# Altium schematic sheet LHS.SchDoc: LHS
size OrCAD A; ApprovedBy: Abbas Mahmoud; CheckedBy: Abbas Mahmoud; Author: Abbas Mahmoud; CompanyName: lsa 4wya :); DrawnBy: Abbas Mahmoud; Engineer: Abbas Mahmoud; DocumentNumber: 7; Revision: 1; SheetNumber: 7; SheetTotal: 8
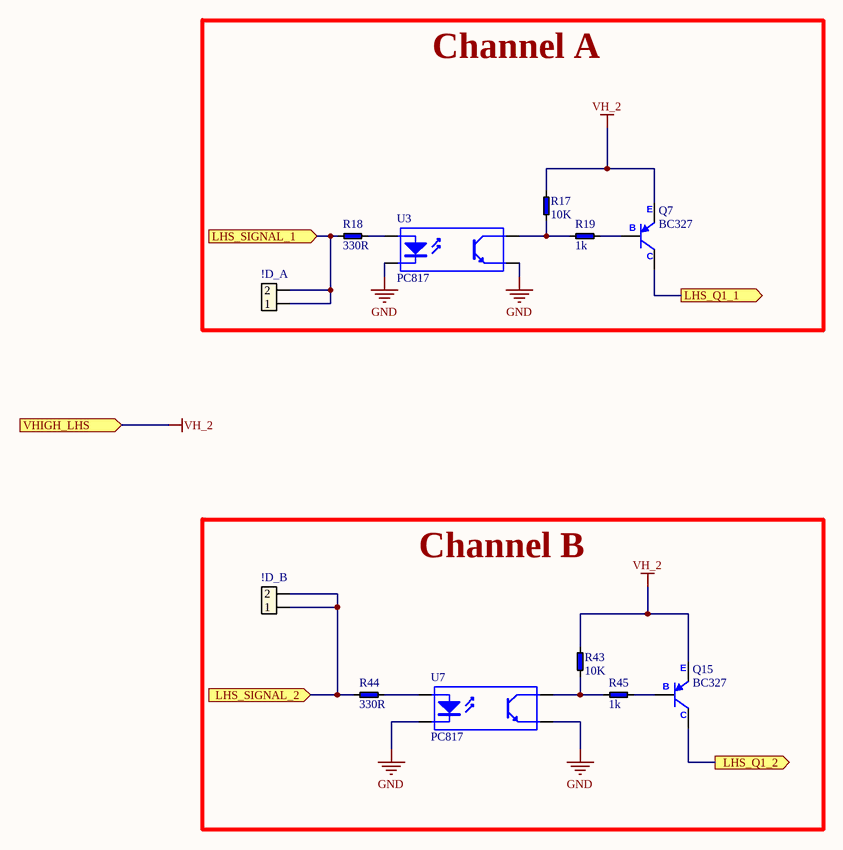
[diagram p0: LHS.SchDoc]

## Parts
!D_A  Header 2  [PINHEADER X2]  (value not drawn)
!D_B  Header 2  [PINHEADER X2]  (value not drawn)
Q7  BC327  [Transistor - duplicate3]
Q15  BC327  [Transistor - duplicate3]
R17  10K  [RESISTOR _9]
R18  330R  [RESISTOR _9]
R19  1k  [RESISTOR _9]
R43  10K  [RESISTOR _9]
R44  330R  [RESISTOR _9]
R45  1k  [RESISTOR _9]
U3  PC817  [IC X4 PIN]
U7  PC817  [IC X4 PIN]

## Blocks framed on the sheet
Channel A: !D_A Q7 R17-R19 U3
Channel B: !D_B Q15 R43-R45 U7

## Ports
LHS_Q1_1 (out), LHS_Q1_2 (out), LHS_SIGNAL_1 (in), LHS_SIGNAL_2 (in), VHIGH_LHS (in)

## Nets
GND: U3.2(K) U3.3(E) U7.2(K) U7.3(E)
VH_2: Q7.1(E) Q15.1(E) R17.1 R43.2 ; port VHIGH_LHS
LHS_Q1_1: Q7.3(C) ; port LHS_Q1_1
LHS_Q1_2: Q15.3(C) ; port LHS_Q1_2
LHS_SIGNAL_1: !D_A.1 !D_A.2 R18.1 ; port LHS_SIGNAL_1
LHS_SIGNAL_2: !D_B.1 !D_B.2 R44.1 ; port LHS_SIGNAL_2
NetQ7_2: Q7.2(B) R19.2
NetQ15_2: Q15.2(B) R45.2
NetR17_2: R17.2 R19.1 U3.4(C)
NetR18_2: R18.2 U3.1(A)
NetR43_1: R43.1 R45.1 U7.4(C)
NetR44_2: R44.2 U7.1(A)

## Notes on the sheet
- Title
- Size:
- Date:
- Orcad A
- Number:
- Time:
- Revision:
- Sheet
- of
- File:

## Library data of the parts
!D_A !D_B = Header 2: Header, 2-Pin; LatestRevisionDate: 17-Jul-2002; LatestRevisionNote: Re-released for DXP Platform.; Publisher: Altium Limited
Q7 Q15 = PNP
R17-R19 R43-R45 = RESISTOR
U3 U7 = Opto-coupler: 4-Pin Phototransistor Optocoupler; Published: 24-Mar-1999; LatestRevisionDate: 04-Mar-2005; LatestRevisionNote: Sch pins 3 & 4 Swapped.; DatasheetVersion: Nov-2003; PackageReference: DIP-4; Publisher: Altium Limited